# EAGLE design main (EAGLE 9.6.2)
TITLE: Petfeeder
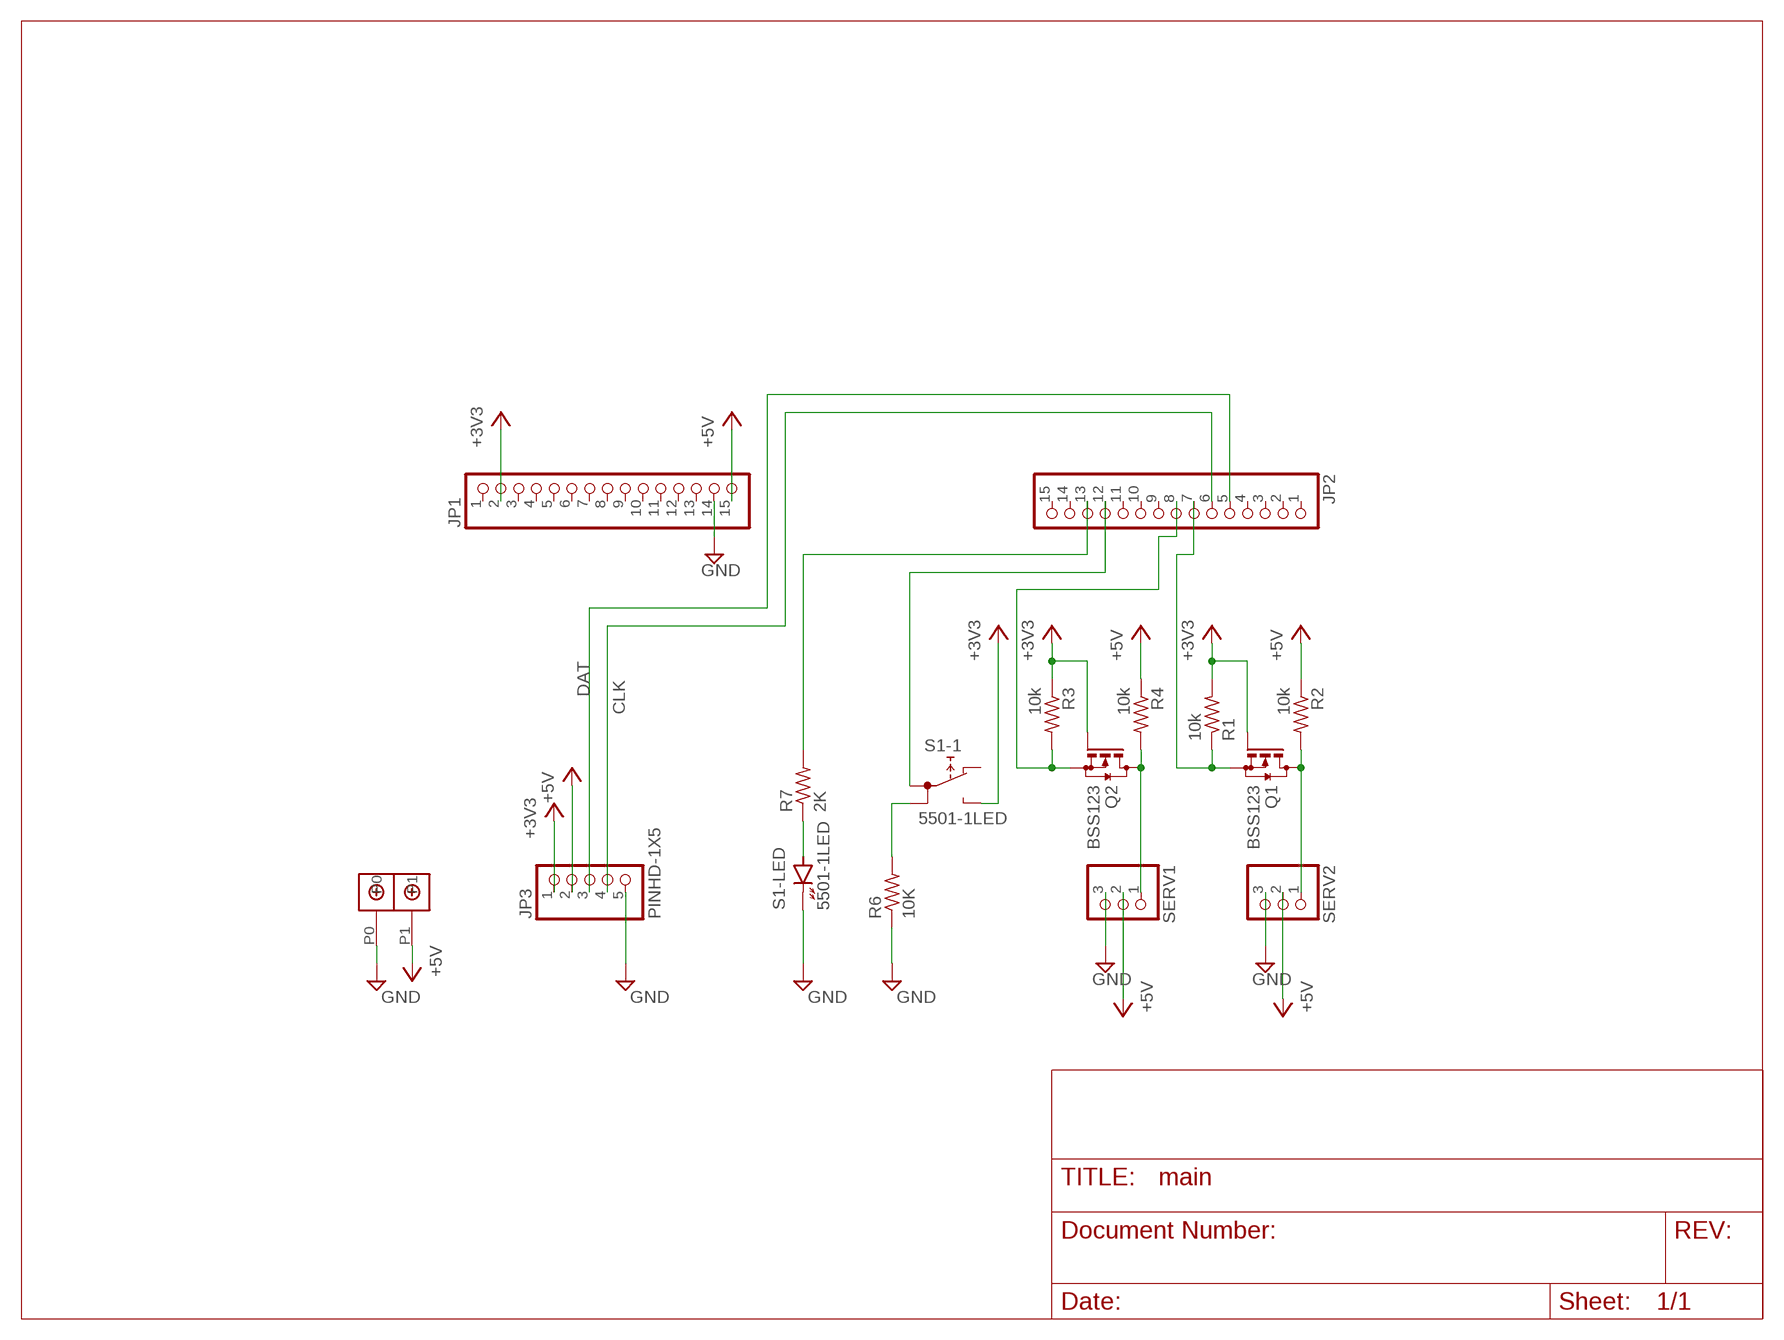
[diagram p0: schematic, sheet 1]

## Parts
JP1  PINHD-1X15  [1X15]
JP2  PINHD-1X15  [1X15]
JP3  PINHD-1X5  [1X05]
Q1  BSS123  [SOT23]
Q2  BSS123  [SOT23]
R1  10k  R-US_M0805  [M0805]
R2  10k  R-US_M0805  [M0805]
R3  10k  R-US_M0805  [M0805]
R4  10k  R-US_M0805  [M0805]
R6  10K  R-US_M0805  [M0805]
R7  2K  R-US_M0805  [M0805]
S1  5501-1LED  [5501-1LED]
SERV1  PINHD-1X3  [1X03]
SERV2  PINHD-1X3  [1X03]
U$1  DBCONN-1X2  [DBCONN-1X2]

## Nets
+3V3: JP1.2 JP3.1 Q1.1(G) Q2.1(G) R1.2 R3.1 S1.NO(-1:NO)
+5V: JP1.15 JP3.2 R2.1 R4.1 SERV1.2 SERV2.2 U$1.P1
GND: JP1.14 JP3.5 R6.1 S1.-(-LED:K) SERV1.3 SERV2.3 U$1.P0
N$1: Q2.3(D) R4.2 SERV1.1
N$2: Q1.3(D) R2.2 SERV2.1
N$3: JP2.7 Q1.2(S) R1.1
N$4: JP2.12 S1.1A(-1:1A)
N$5: R7.1 S1.+(-LED:A)
N$6: JP2.13 R7.2
N$7: JP2.5 JP3.3
N$8: JP2.6 JP3.4
N$9: JP2.8 Q2.2(S) R3.2
N$10: R6.2 S1.1B(-1:1B)
Unconnected: JP1.1 JP1.3 JP1.4 JP1.5 JP1.6 JP1.7 JP1.8 JP1.9 JP1.10 JP1.11 JP1.12 JP1.13 JP2.1 JP2.2 JP2.3 JP2.4 JP2.9 JP2.10 JP2.11 JP2.14 JP2.15 S1.NC(-1:NC)

## Notes on the sheet
- DAT
- CLK

## Library data of the parts
JP1 JP2 = pinhead:PINHD-1X15: PIN HEADER
JP3 = Connector:PINHD-1X5: PIN HEADER; CATEGORY: CONNECTOR; SUB-CATEGORY: PIN-HEADER
Q1 Q2 = transistor-small-signal:BSS123: N-CHANNEL MOS FET
R1-R4 R6 R7 = rcl:R-US_: RESISTOR, American symbol; SPICEPREFIX: R
S1 = switch:55?-1LED: PUSHBUTTON SERIES 5500 SWITCHES 1 LED Source: www.e-switch.com .. 5500.pdf
SERV1 SERV2 = pinhead:PINHD-1X3: PIN HEADER
U$1 = Terminal Block Connector:DBCONN-1X2

## Board
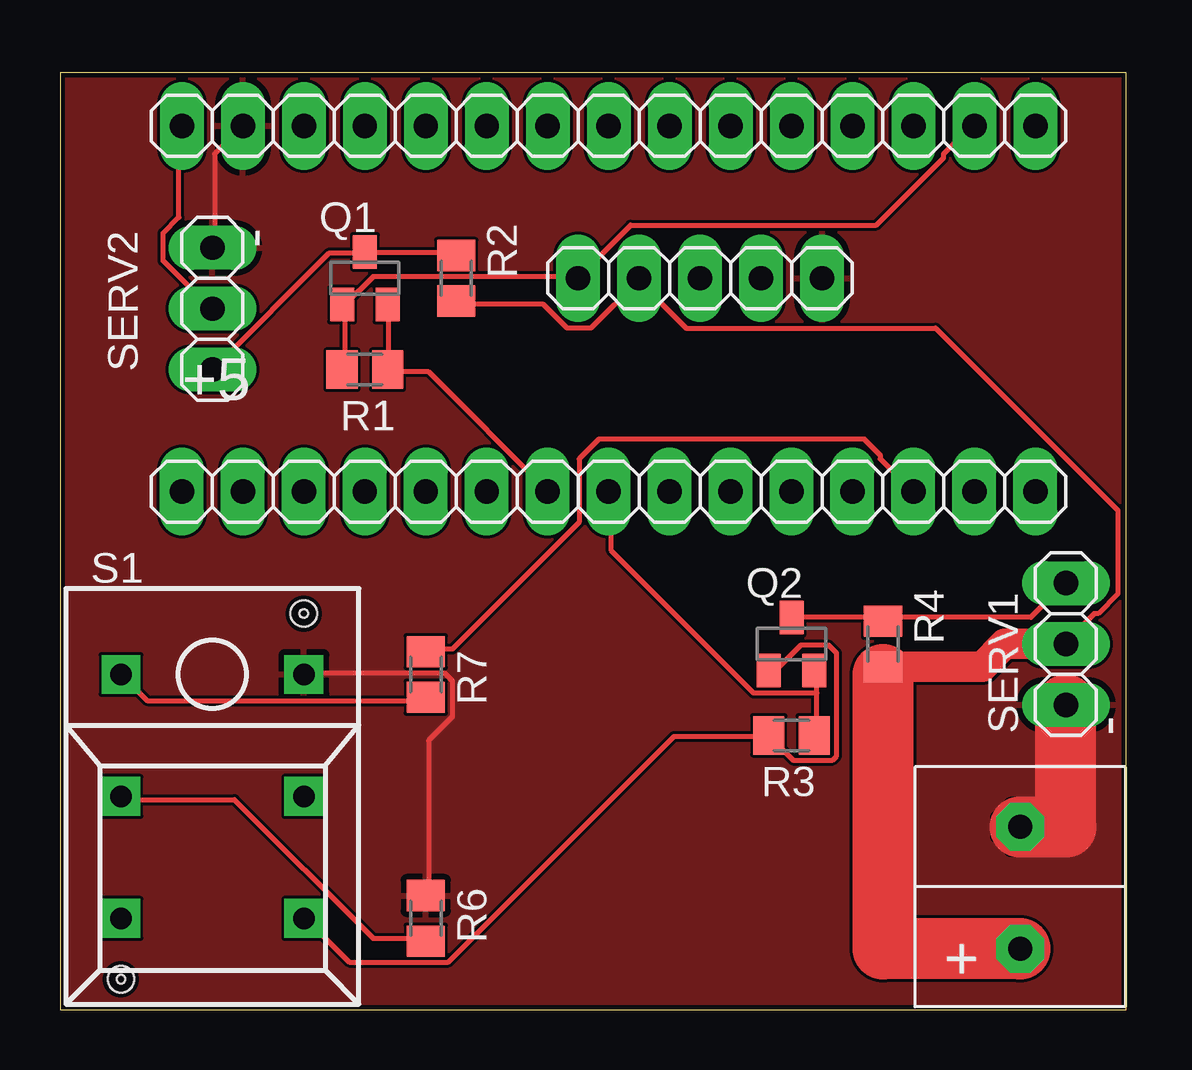
[diagram p1: board, top side]
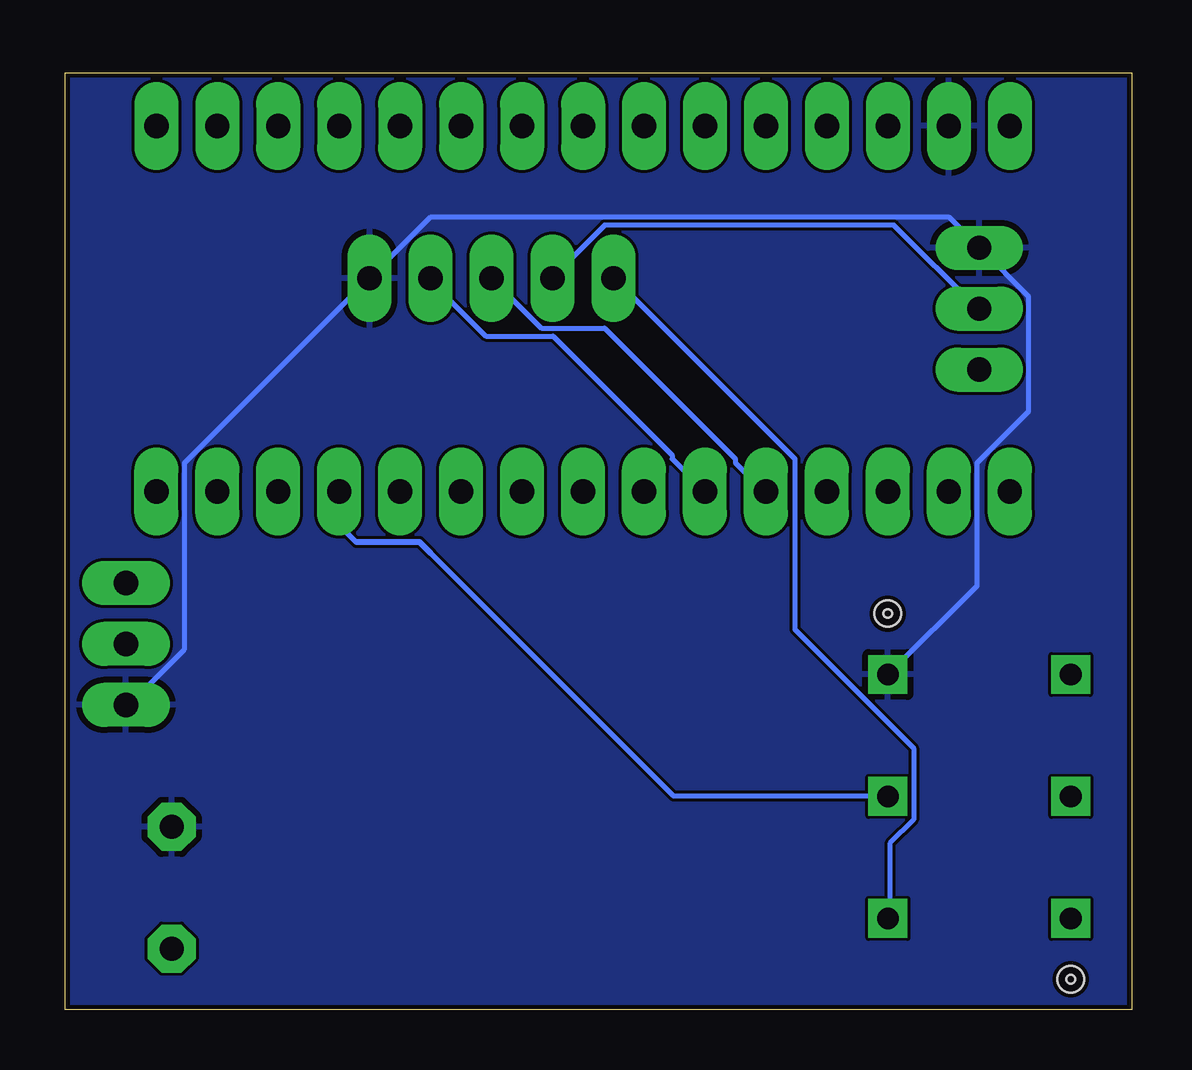
[diagram p2: board, bottom side, seen from below]

Size 44.43 x 39.04 mm. Coordinates in mm from the lower left corner, seen from the top.
Outline: 0,0 44.43,0 44.43,39.04 0,39.04 0,0
Copper layers (1*16): Top 0.035mm / dielectric 1.6mm / Bottom 0.035mm
Design rules "jlcpcb-2layers *": minimum track width 8mil, minimum drill 0.3mm, track to track 5mil, track to pad 5mil, pad to pad 5mil, via to via 5mil, smd to smd 5mil, copper to edge 0.2mm, drill to drill 6mil, minimum pad ring 10mil, minimum via ring 3mil, stop-mask expansion 4mil, vias tented up to drill 0mil, thermal gap 10mil
Holes 0.35 mm at 10.16,16.51 2.54,1.27

### Footprints (pad centres in the part's own frame; a part is rotated, then mirrored left to right if it is on the bottom)
1X15 = drill 1.016 long: 1 -17.78,0; 2 -15.24,0; 3 -12.7,0; 4 -10.16,0; 5 -7.62,0; 6 -5.08,0; 7 -2.54,0; 8 0,0; 9 2.54,0; 10 5.08,0; 11 7.62,0; 12 10.16,0; 13 12.7,0; 14 15.24,0; 15 17.78,0
1X05 = drill 1.016 long: 1 -5.08,0; 2 -2.54,0; 3 0,0; 4 2.54,0; 5 5.08,0
SOT23 = smd 1 x 1.4: 1 -0.95,-1.1; 2 0.95,-1.1; 3 0,1.1
M0805 = smd 1.3 x 1.6: 1 -0.95,0; 2 0.95,0
5501-1LED = drill 0.9 pad 1.5 square: 1A 0,3.81; 1B 0,-3.81; + -5.08,-3.81; - -5.08,3.81; NC 5.08,-3.81; NO 5.08,3.81 | hole 1.1: -7.62,3.81; 7.62,-3.81
1X03 = drill 1.016 long: 1 -2.54,0; 2 0,0; 3 2.54,0
DBCONN-1X2 = drill 1 pad 2 octagon: P0 -2.54,-0.635; P1 2.536,-0.635

### Placement (x,y rotation side)
JP1  22.86,36.83 180 top
JP2  22.86,21.59 0 top
JP3  26.67,30.48 0 top
Q1  12.7,30.48 0 top
Q2  30.48,15.24 0 top
R1  12.7,26.67 180 top
R2  16.51,30.48 90 top
R3  30.48,11.43 0 top
R4  34.29,15.24 90 top
R6  15.24,3.81 270 top
R7  15.24,13.97 90 top
S1  6.35,8.89 270 top
SERV1  41.91,15.24 270 top
SERV2  6.35,29.21 90 top
U$1  40.64,5.08 270 top

### Tracks (layer width: path | path; a pad name or v marks a point on that pad's centre or on a via)
+3V3
  Top 0.203: Q2.1 29.55,14.2 29.88,14.2 30.87,15.19 32.03,15.19 32.36,14.86 32.36,10.57 32.19,10.4 30.54,10.4 29.55,11.39 R3.1 29.39,11.39 25.59,11.39 16.18,1.98 12.05,1.98 10.24,3.8 S1.NO | R1.2 11.89,26.75 11.89,29.22 Q1.1 11.89,29.39 13.04,30.54 21.46,30.54 JP3.1 21.63,30.54 23.77,32.69 34.01,32.69 36.82,35.5 36.82,35.66 37.97,36.82 JP1.2
  Bottom 0.203: S1.NO 10.07,3.96 10.07,6.93 9.08,7.92 9.08,10.9 14.03,15.85 14.03,22.95 21.46,30.38 JP3.1
+5V
  Top 0.203: 41.77,15.19 SERV1.2 41.94,15.35 43.09,16.51 43.26,16.51 44.08,17.34 44.08,20.8 36.49,28.4 26.09,28.4 24.11,30.38 | 24.11,30.38 22.12,28.4 21.13,28.4 20.14,29.39 16.51,29.39 R2.1 | JP1.15 4.95,36.82 4.95,33.02 4.29,32.36 4.29,31.2 6.27,29.22 SERV2.2 | 24.11,30.38 JP3.2
  Top 1.27: 41.77,15.19 41.72,15.24 39.37,15.24 38.42,14.29 R4.1 34.29,14.31 34.34,14.36 34.34,14.02 34.29,13.97
  Top 2.54: U$1.P1 34.29,2.54 34.29,13.97
  Bottom 0.203: JP3.2 24.11,30.54 21.96,32.69 9.91,32.69 6.44,29.22 SERV2.2
GND
  Top 0.203: SERV2.3 6.44,31.86 6.44,35.66 7.59,36.82 JP1.14 | R6.1 15.35,4.79 15.35,11.23 16.34,12.22 16.34,13.7 16.02,14.03 10.24,14.03 S1.-
  Top 2.54: U$1.P0 41.91,7.62 SERV1.3
  Bottom 0.203: SERV1.3 41.77,12.71 39.46,15.02 39.46,22.78 31.86,30.38 JP3.5 31.7,30.54 29.22,33.02 7.59,33.02 6.44,31.86 SERV2.3 6.27,31.7 4.29,29.72 4.29,24.93 6.44,22.78 6.44,17.67 10.07,14.03 S1.-
  pour Top: 0,39.37 44.45,39.37 44.45,0 0,0
  pour Bottom: 0,39.37 44.45,39.37 44.45,0 0,0
N$1
  Top 0.203: Q2.3 30.54,16.34 34.18,16.34 R4.2 34.34,16.34 40.45,16.34 41.77,17.67 SERV1.1
N$2
  Top 0.203: R2.2 16.51,31.53 12.71,31.53 Q1.3 12.55,31.53 11.23,31.53 6.44,26.75 SERV2.1
N$3
  Top 0.203: Q1.2 13.7,29.22 13.7,26.75 R1.1 13.7,26.58 15.35,26.58 20.31,21.63 JP2.7
N$4
  Bottom 0.203: 29.22,19.04 19.1,8.91 10.24,8.91 S1.1A | 32.31,19.48 33.02,20.19 JP2.12
  Bottom 0.254: 29.22,19.04 29.67,19.48 32.31,19.48
N$5
  Top 0.203: S1.+ 3.63,12.88 15.19,12.88 R7.1
N$6
  Top 0.203: R7.2 15.35,15.02 16.34,15.02 21.63,20.31 21.63,22.95 22.45,23.77 33.52,23.77 34.18,23.11 34.18,22.95 35.5,21.63 JP2.13
N$7
  Bottom 0.203: JP2.5 15.35,21.63 16.51,22.78 16.51,22.95 21.96,28.4 24.6,28.4 26.58,30.38 JP3.3
N$8
  Bottom 0.203: JP2.6 17.83,21.63 19.15,22.95 19.15,23.11 24.11,28.07 26.91,28.07 29.22,30.38 JP3.4
N$9
  Top 0.203: 31.53,13.21 31.53,11.56 R3.2 | 31.53,13.21 31.53,14.03 Q2.2 | 31.53,13.21 28.89,13.21 22.95,19.15 22.95,21.46 JP2.8
N$10
  Top 0.203: R6.2 15.19,2.97 13.04,2.97 7.26,8.75 2.64,8.75 S1.1B

### Text on the board
tNames: - | +5 | - | +